# Altium project CANLINK_revA.PrjPcb
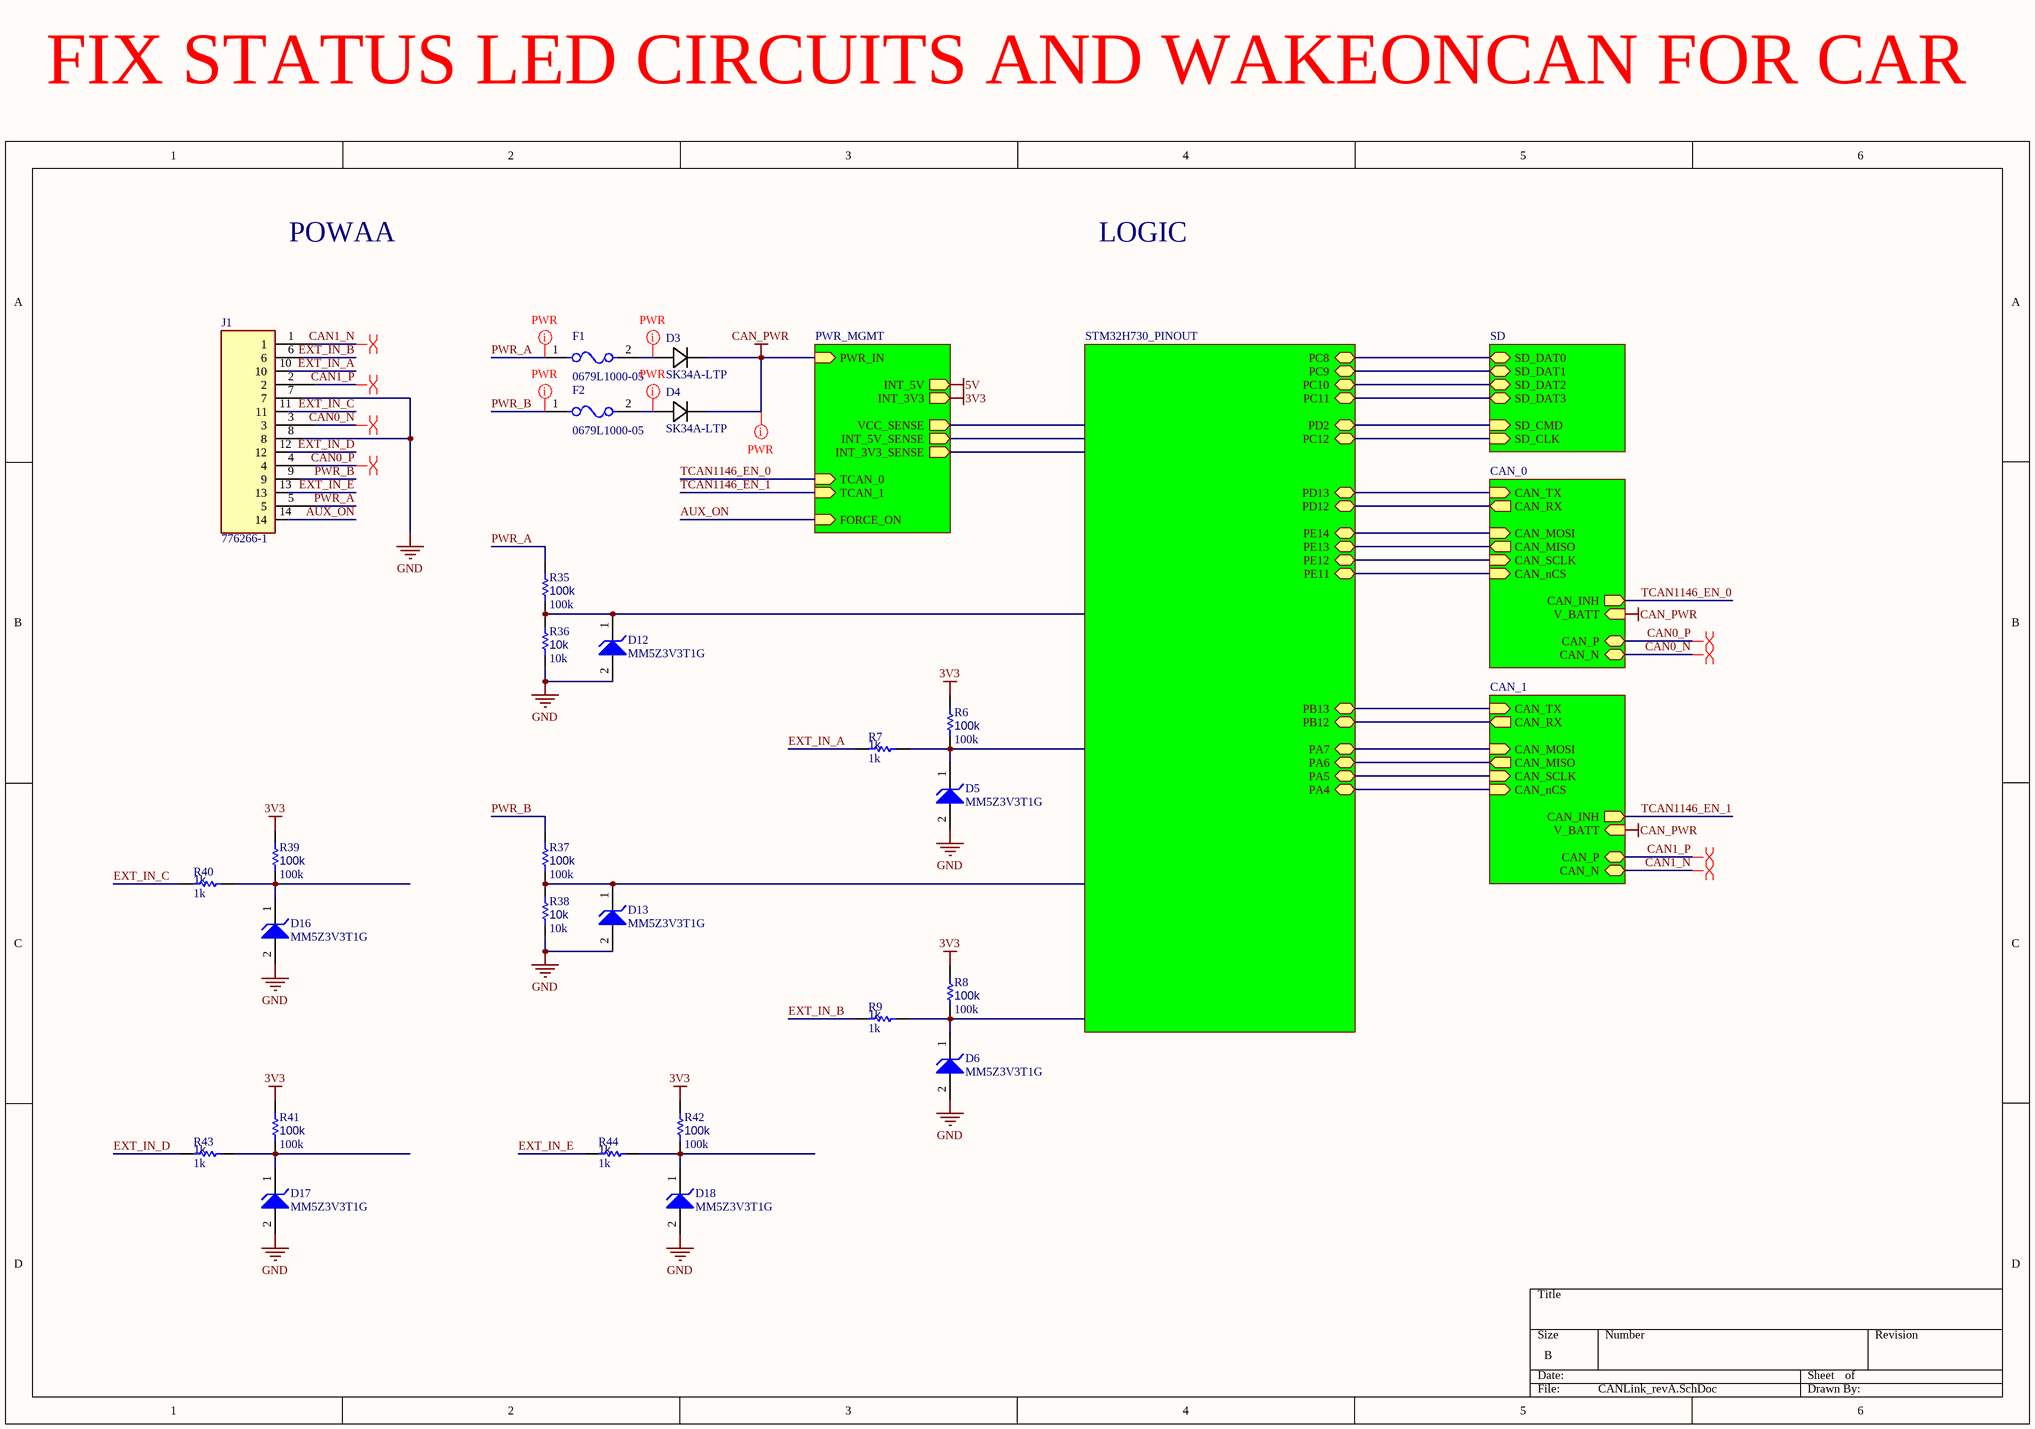
[diagram p0: CANLink_revA.SchDoc]
4 sheets, 98 parts. Net scope: hierarchical (ports join the sheet entries above them; power ports are global).
Board file: CANLINK_revA.PcbDoc
Sheets:
  CANLink_revA.SchDoc
    MCU_0 = STM32H730_PINOUT.SchDoc
    SD_0 = SD.SchDoc
    PWR_MGMT = PWR_MGMT.SchDoc

## Sheet CANLink_revA.SchDoc
size B; SheetNumber: 1; SheetTotal: 5

### Parts
D3  SK34A-LTP  [SK34A-LTP-Footprint-1]
D4  SK34A-LTP  [SK34A-LTP-Footprint-1]
D5  MM5Z3V3T1G  [ONSC-SOD-523-2-502-01_V]
D6  MM5Z3V3T1G  [ONSC-SOD-523-2-502-01_V]
D12  MM5Z3V3T1G  [ONSC-SOD-523-2-502-01_V]
D13  MM5Z3V3T1G  [ONSC-SOD-523-2-502-01_V]
D16  MM5Z3V3T1G  [ONSC-SOD-523-2-502-01_V]
D17  MM5Z3V3T1G  [ONSC-SOD-523-2-502-01_V]
D18  MM5Z3V3T1G  [ONSC-SOD-523-2-502-01_V]
F1  0679L1000-05  [FP-0679L-MFG]
F2  0679L1000-05  [FP-0679L-MFG]
J1  776266-1  [776266-1-Footprint-1]
R6  100k  [R0603B]
R7  1k  [R0603B]
R8  100k  [R0603B]
R9  1k  [R0603B]
R35  100k  [R0603B]
R36  10k  [R0603B]
R37  100k  [R0603B]
R38  10k  [R0603B]
R39  100k  [R0603B]
R40  1k  [R0603B]
R41  100k  [R0603B]
R42  100k  [R0603B]
R43  1k  [R0603B]
R44  1k  [R0603B]

### Sub-sheets
CAN_0 = TCAN1146_PINOUT (file not in this document): CAN_TX (in), CAN_RX (out), CAN_SCLK (in), CAN_MISO (out), CAN_MOSI (in), CAN_nCS (in), CAN_INH (out), V_BATT (in), CAN_P (bidir), CAN_N (bidir)
CAN_1 = TCAN1146_PINOUT (file not in this document): CAN_TX (in), CAN_RX (out), CAN_SCLK (in), CAN_MISO (out), CAN_MOSI (in), CAN_nCS (in), CAN_INH (out), V_BATT (in), CAN_P (bidir), CAN_N (bidir)
MCU_0 = STM32H730_PINOUT: PB12 (bidir), PB13 (bidir), PA4 (bidir), PA5 (bidir), PA6 (bidir), PA7 (bidir), PD12 (bidir), PD13 (bidir), PE11 (bidir), PE12 (bidir), PE13 (bidir), PE14 (bidir), PC9 (bidir), PC10 (bidir), PC11 (bidir), PC12 (bidir), PD2 (bidir), PC8 (bidir)
PWR_MGMT = PWR_MGMT: PWR_IN (in), INT_3V3 (out), VCC_SENSE (out), INT_3V3_SENSE (out), FORCE_ON (in), TCAN_0 (in), TCAN_1 (in), INT_5V (out), INT_5V_SENSE (out)
SD_0 = SD: SD_DAT0 (bidir), SD_DAT1 (bidir), SD_DAT2 (bidir), SD_DAT3 (bidir), SD_CMD (in), SD_CLK (in)

### Nets
3V3: R6.1 R8.1 R39.1 R41.1 R42.1 ; sheet PWR_MGMT/INT_3V3
CAN_PWR: D3.1(CATHODE) D4.1(CATHODE) ; sheet CAN_1/V_BATT, sheet PWR_MGMT/PWR_IN, sheet CAN_0/V_BATT
GND: D5.2(A) D6.2(A) D12.2(A) D13.2(A) D16.2(A) D17.2(A) D18.2(A) J1.7 J1.8 R36.2 R38.2
AUX_ON: J1.14 ; sheet PWR_MGMT/FORCE_ON
CAN0_N: J1.3 ; sheet CAN_0/CAN_N
CAN0_P: J1.4 ; sheet CAN_0/CAN_P
CAN1_N: J1.1 ; sheet CAN_1/CAN_N
CAN1_P: J1.2 ; sheet CAN_1/CAN_P
EXT_IN_A: J1.10 R7.2
EXT_IN_B: J1.6 R9.2
EXT_IN_C: J1.11 R40.2
EXT_IN_D: J1.12 R43.2
EXT_IN_E: J1.13 R44.2
PWR_A: F1.1 J1.5 R35.1
PWR_B: F2.1 J1.9 R37.1
SD_CLK: sheet MCU_0/PC12, sheet SD_0/SD_CLK
SD_CMD: sheet MCU_0/PD2, sheet SD_0/SD_CMD
SD_DAT0: sheet MCU_0/PC8, sheet SD_0/SD_DAT0
SD_DAT1: sheet MCU_0/PC9, sheet SD_0/SD_DAT1
SD_DAT2: sheet MCU_0/PC10, sheet SD_0/SD_DAT2
SD_DAT3: sheet MCU_0/PC11, sheet SD_0/SD_DAT3
TCAN1146_EN_0: sheet PWR_MGMT/TCAN_0, sheet CAN_0/CAN_INH
TCAN1146_EN_1: sheet CAN_1/CAN_INH, sheet PWR_MGMT/TCAN_1
NetD3_2: D3.2(ANODE) F1.2
NetD4_2: D4.2(ANODE) F2.2
NetD5_1: D5.1(K) R6.2 R7.1
NetD6_1: D6.1(K) R8.2 R9.1
NetD12_1: D12.1(K) R35.2 R36.1
NetD13_1: D13.1(K) R37.2 R38.1
NetD16_1: D16.1(K) R39.2 R40.1
NetD17_1: D17.1(K) R41.2 R43.1
NetD18_1: D18.1(K) R42.2 R44.1
NetU4_28: sheet MCU_0/PA4, sheet CAN_1/CAN_nCS
NetU4_29: sheet MCU_0/PA5, sheet CAN_1/CAN_SCLK
NetU4_30: sheet MCU_0/PA6, sheet CAN_1/CAN_MISO
NetU4_31: sheet MCU_0/PA7, sheet CAN_1/CAN_MOSI
NetU4_41: sheet MCU_0/PE11, sheet CAN_0/CAN_nCS
NetU4_42: sheet MCU_0/PE12, sheet CAN_0/CAN_SCLK
NetU4_43: sheet MCU_0/PE13, sheet CAN_0/CAN_MISO
NetU4_44: sheet MCU_0/PE14, sheet CAN_0/CAN_MOSI
NetU4_51: sheet MCU_0/PB12, sheet CAN_1/CAN_RX
NetU4_52: sheet MCU_0/PB13, sheet CAN_1/CAN_TX
NetU4_59: sheet MCU_0/PD12, sheet CAN_0/CAN_RX
NetU4_60: sheet MCU_0/PD13, sheet CAN_0/CAN_TX

### Layout directives
differential pair: CAN0_N, CAN0_P, CAN1_N, CAN1_P
net class PWR: CAN_PWR, NetD3_2, NetD4_2, PWR_A, PWR_B

### Notes on the sheet
- FIX STATUS LED CIRCUITS AND WAKEONCAN FOR CAR
- POWAA
- LOGIC

### Library data of the parts
D3 D4 = CMP-004-00058-2: Rectifier Diode, Schottky, 1 Phase, 1 Element, 3A, 40V V(RRM), Silicon, DO-214AC; Forward Voltage: 500mV; Max Operating Temperature: 125°C; Pins: 2; RoHS Compliant: Yes
D5 D6 D12 D13 D16-D18 = CMP-1060-00750-1: Zener Voltage Regulator, 500 mW, 2-Pin SOD-523, Pb-Free, Tape and Reel; Manufacturer: On Semiconductor; P Max (W): 0.5; VZ Typ (V): 3.3; RoHS: Pb-Free; ComponentLink2Description: Datasheet; PackageReference: SOD-523-2-502-01; DatasheetVersion: Rev. 10; ComponentLink1Description: Manufacturer URL; PackageVersion: Rev. E, 09/2010; ComponentLink3URL: http://www.onsemi.com/pub_link/Collateral/502-01.PDF; ComponentLink2URL: http://www.onsemi.cn/pub_link/Collateral/MM5Z2V4T1-D.PDF; Mounting Technology: Surface Mount; PartNumber: MM5Z3V3T1G; Packing: Tape and Reel; PackageDescription: 2-Pin SOD, Body 1.2 x 0.8 mm; ComponentLink1URL: http://www.onsemi.com/; ComponentLink3Description: Package Specification
F1 F2 = CMP-16042-000002-1: DIFF P#!!! / FUSE BRD MNT 1A 125VAC/VDC; Manufacturer: Bel Fuse; Manufacturer Part Number: 0679L9150-01; Max Fuse Ac Voltage: 125V; Fuse Blow Speed: Fast; Fuse Current: 15A; Fuse I2T: 103.5A2Sec; Fuse Interrupt Ac Current: 50A; Automotive Grade: Grade 1; Value: 0.0038Ω; Fuse Interrupt Dc Current: 300A; Fuse Voltage Drop: 0.13V; Device Class L2: Fuses; ComponentLink2URL: https://www.belfuse.com/resources/CircuitProtection/datasheets/0679L%20Sep2016.pdf; Package: 0679L; Height: 2.79mm; Digikey Description: FUSE BRD MNT 15A 125VAC/VDC; Temperature Range High: +125°C; Device Class L3: unset; Octopart: https://octopart.com/0679l9150-01-bel+fuse-70850665; Temperature Range Low: -55°C; Max Fuse Dc Voltage: 125V; Ipc Land Pattern Name: CAPC610254X254; Category: Fuse; Lead Free: Yes; Automotive: Yes; Resistance: 0.0038Ω; RoHS: TRUE; Device Class L1: Circuit Protection; ComponentLink2Description: Datasheet; Temperature: -55°C to +125°C; Voltage Rating: 125V
J1 = CMP-002-00087-1: Board Connector; Connector Type: BOARD CONNECTOR; RoHS Compliant: Yes
R6-R9 R35-R44 = CMP-009-00002-14: Resistor
  R6 R8 R35 R37 R39 R41 R42: Value: 100k
  R7 R9 R40 R43 R44: Value: 1k
  R36 R38: Value: 10k

## Sheet STM32H730_PINOUT.SchDoc
size C; SheetNumber: 5; SheetTotal: 5
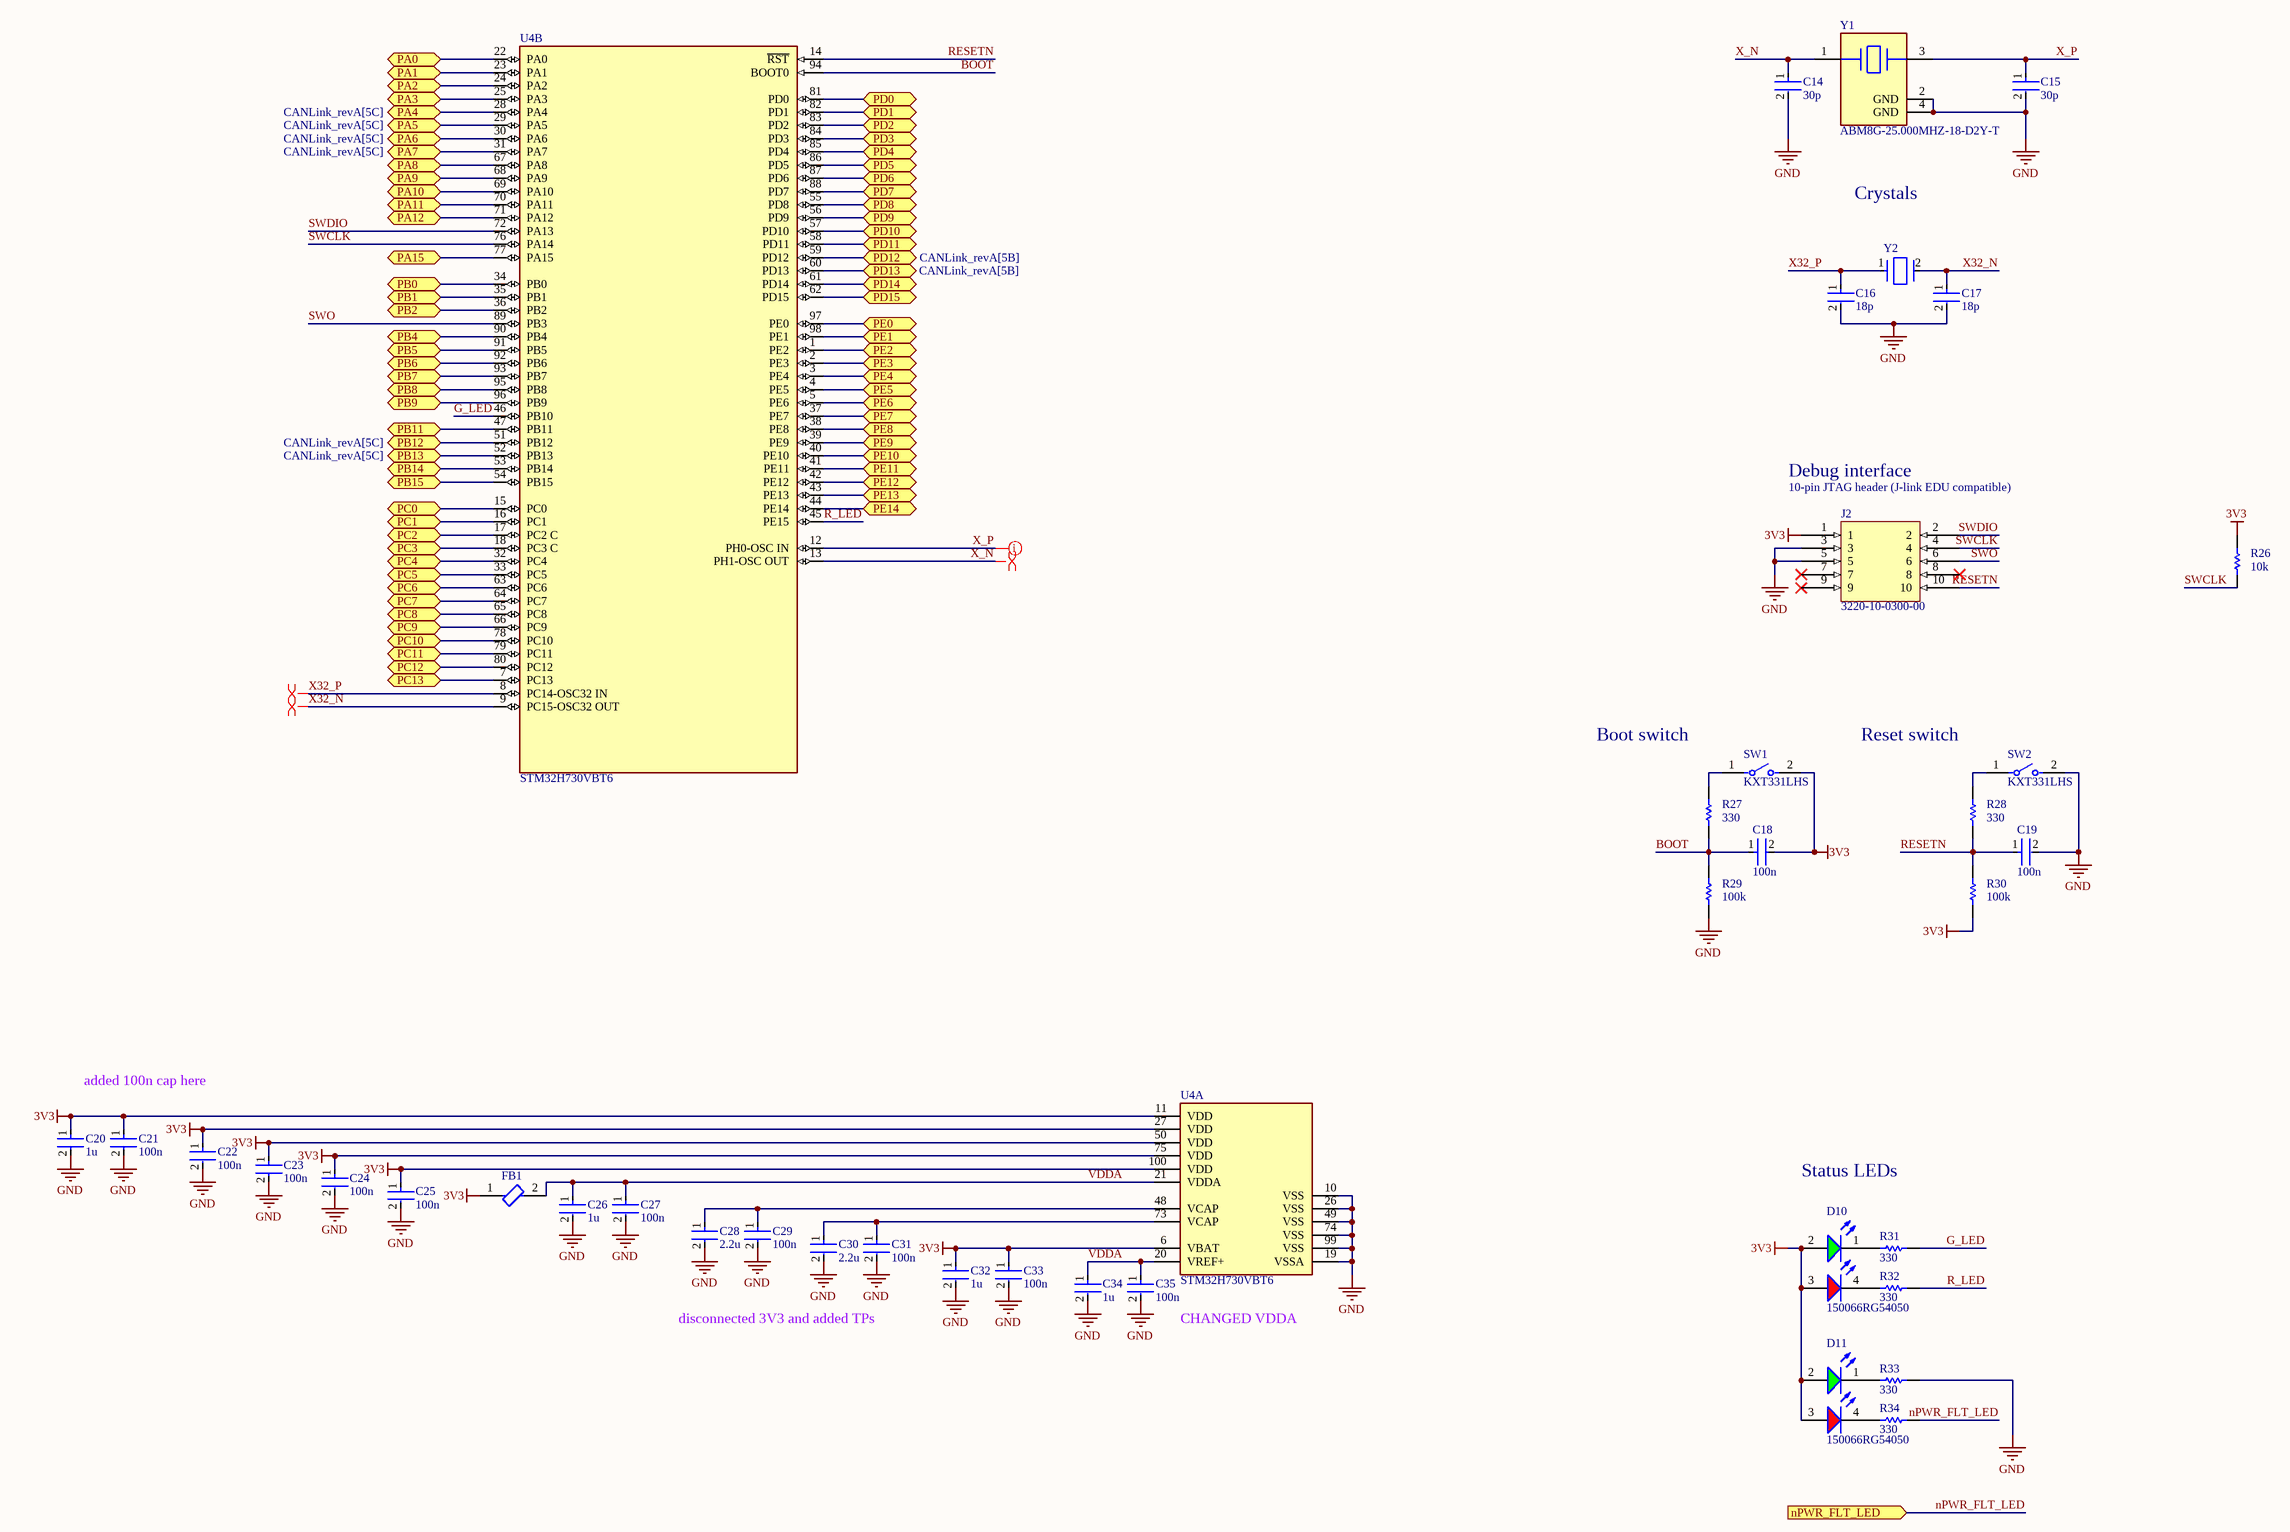
[diagram p1: STM32H730_PINOUT.SchDoc]

### Parts
C14  30p  [FP-0402-L_1_0_0_05-W_0_5-IPC_A]
C15  30p  [FP-0402-L_1_0_0_05-W_0_5-IPC_A]
C16  18p  [FP-0402-L_1_0_0_05-W_0_5-IPC_A]
C17  18p  [FP-0402-L_1_0_0_05-W_0_5-IPC_A]
C18  100n  [FP-0402-L_1_0_0_05-W_0_5-IPC_A]
C19  100n  [FP-0402-L_1_0_0_05-W_0_5-IPC_A]
C20  1u  [FP-0402-L_1_0_0_05-W_0_5-IPC_A]
C21  100n  [FP-0402-L_1_0_0_05-W_0_5-IPC_A]
C22  100n  [FP-0402-L_1_0_0_05-W_0_5-IPC_A]
C23  100n  [FP-0402-L_1_0_0_05-W_0_5-IPC_A]
C24  100n  [FP-0402-L_1_0_0_05-W_0_5-IPC_A]
C25  100n  [FP-0402-L_1_0_0_05-W_0_5-IPC_A]
C26  1u  [FP-0402-L_1_0_0_05-W_0_5-IPC_A]
C27  100n  [FP-0402-L_1_0_0_05-W_0_5-IPC_A]
C28  2.2u  [FP-0402-L_1_0_0_05-W_0_5-IPC_A]
C29  100n  [FP-0402-L_1_0_0_05-W_0_5-IPC_A]
C30  2.2u  [FP-0402-L_1_0_0_05-W_0_5-IPC_A]
C31  100n  [FP-0402-L_1_0_0_05-W_0_5-IPC_A]
C32  1u  [FP-0402-L_1_0_0_05-W_0_5-IPC_A]
C33  100n  [FP-0402-L_1_0_0_05-W_0_5-IPC_A]
C34  1u  [FP-0402-L_1_0_0_05-W_0_5-IPC_A]
C35  100n  [FP-0402-L_1_0_0_05-W_0_5-IPC_A]
D10  150066RG54050  [WL-SBCD_0606]
D11  150066RG54050  [WL-SBCD_0606]
FB1  BLM15PX601SN1D  [FP-BLM15-0_05-IPC_A]  (value not drawn)
J2  3220-10-0300-00  [3220-10-0300-00-Footprint-1]
R26  10k  [R0603B]
R27  330  [R0603B]
R28  330  [R0603B]
R29  100k  [R0603B]
R30  100k  [R0603B]
R31  330  [R0603B]
R32  330  [R0603B]
R33  330  [R0603B]
R34  330  [R0603B]
SW1  KXT331LHS  [FP-KXT331LHS-MFG]
SW2  KXT331LHS  [FP-KXT331LHS-MFG]
U4  STM32H730VBT6  [FP-LQFP100-1L-IPC_C]  (parts A,B of 2)
Y1  ABM8G-25.000MHZ-18-D2Y-T  [FP-ABM8G-MFG]
Y2  ECS-.327-12.5-1210-TR  [FP-ECX-1210-MFG]  (value not drawn)

### Ports
nPWR_FLT_LED (in), PA0 (bidir), PA1 (bidir), PA2 (bidir), PA3 (bidir), PA4 (bidir, see CANLink_revA[5C]), PA5 (bidir, see CANLink_revA[5C]), PA6 (bidir, see CANLink_revA[5C]), PA7 (bidir, see CANLink_revA[5C]), PA8 (bidir), PA9 (bidir), PA10 (bidir), PA11 (bidir), PA12 (bidir), PA15 (bidir), PB0 (bidir), PB1 (bidir), PB2 (bidir), PB4 (bidir), PB5 (bidir), PB6 (bidir), PB7 (bidir), PB8 (bidir), PB9 (bidir), PB11 (bidir), PB12 (bidir, see CANLink_revA[5C]), PB13 (bidir, see CANLink_revA[5C]), PB14 (bidir), PB15 (bidir), PC0 (bidir), PC1 (bidir), PC2 (bidir), PC3 (bidir), PC4 (bidir), PC5 (bidir), PC6 (bidir), PC7 (bidir), PC8 (bidir), PC9 (bidir), PC10 (bidir), PC11 (bidir), PC12 (bidir), PC13 (bidir), PD0 (bidir), PD1 (bidir), PD2 (bidir), PD3 (bidir), PD4 (bidir), PD5 (bidir), PD6 (bidir), PD7 (bidir), PD8 (bidir), PD9 (bidir), PD10 (bidir), PD11 (bidir), PD12 (bidir, see CANLink_revA[5B]), PD13 (bidir, see CANLink_revA[5B]), PD14 (bidir), PD15 (bidir), PE0 (bidir), PE1 (bidir), PE2 (bidir), PE3 (bidir), PE4 (bidir), PE5 (bidir), PE6 (bidir), PE7 (bidir), PE8 (bidir), PE9 (bidir), PE10 (bidir), PE11 (bidir), PE12 (bidir), PE13 (bidir), PE14 (bidir)

### Nets
3V3: C18.2 C20.1 C21.1 C22.1 C23.1 C24.1 C25.1 C32.1 C33.1 D10.2(A) D10.3(A) D11.2(A) D11.3(A) FB1.1 J2.1 R26.2 R30.1 SW1.2 U4.6(VBAT) U4.11(VDD) U4.27(VDD) U4.50(VDD) U4.75(VDD) U4.100(VDD)
GND: C14.2 C15.2 C16.2 C17.2 C19.2 C20.2 C21.2 C22.2 C23.2 C24.2 C25.2 C26.2 C27.2 C28.2 C29.2 C30.2 C31.2 C32.2 C33.2 C34.2 C35.2 J2.3 J2.5 R29.1 R33.1 SW2.2 U4.10(VSS) U4.19(VSSA) U4.26(VSS) U4.49(VSS) U4.74(VSS) U4.99(VSS) Y1.2(GND) Y1.4(GND)
BOOT: C18.1 R27.1 R29.2 U4.94(BOOT0)
G_LED: R31.1 U4.46(PB10)
nPWR_FLT_LED: R34.1 ; port nPWR_FLT_LED
R_LED: R32.1 U4.45(PE15)
RESETN: C19.1 J2.10 R28.1 R30.2 U4.14(~{RST})
SD_CLK: U4.80(PC12) ; port PC12
SD_CMD: U4.83(PD2) ; port PD2
SD_DAT0: U4.65(PC8) ; port PC8
SD_DAT1: U4.66(PC9) ; port PC9
SD_DAT2: U4.78(PC10) ; port PC10
SD_DAT3: U4.79(PC11) ; port PC11
SWCLK: J2.4 R26.1 U4.76(PA14)
SWDIO: J2.2 U4.72(PA13)
SWO: J2.6 U4.89(PB3)
VDDA: C26.1 C27.1 C34.1 C35.1 FB1.2 U4.20(VREF+) U4.21(VDDA)
X32_N: C17.1 U4.9(PC15-OSC32_OUT) Y2.2(Out/In)
X32_P: C16.1 U4.8(PC14-OSC32_IN) Y2.1(In/Out)
X_N: C14.1 U4.13(PH1-OSC_OUT) Y1.1
X_P: C15.1 U4.12(PH0-OSC_IN) Y1.3
NetC28_1: C28.1 C29.1 U4.48(VCAP)
NetC30_1: C30.1 C31.1 U4.73(VCAP)
NetD10_1: D10.1(K) R31.2
NetD10_4: D10.4(K) R32.2
NetD11_1: D11.1(K) R33.2
NetD11_4: D11.4(K) R34.2
NetR27_2: R27.2 SW1.1
NetR28_2: R28.2 SW2.1
NetU4_1: U4.1(PE2) ; port PE2
NetU4_2: U4.2(PE3) ; port PE3
NetU4_3: U4.3(PE4) ; port PE4
NetU4_4: U4.4(PE5) ; port PE5
NetU4_5: U4.5(PE6) ; port PE6
NetU4_7: U4.7(PC13) ; port PC13
NetU4_15: U4.15(PC0) ; port PC0
NetU4_16: U4.16(PC1) ; port PC1
NetU4_17: U4.17(PC2_C) ; port PC2
NetU4_18: U4.18(PC3_C) ; port PC3
NetU4_22: U4.22(PA0) ; port PA0
NetU4_23: U4.23(PA1) ; port PA1
NetU4_24: U4.24(PA2) ; port PA2
NetU4_25: U4.25(PA3) ; port PA3
NetU4_28: U4.28(PA4) ; port PA4
NetU4_29: U4.29(PA5) ; port PA5
NetU4_30: U4.30(PA6) ; port PA6
NetU4_31: U4.31(PA7) ; port PA7
NetU4_32: U4.32(PC4) ; port PC4
NetU4_33: U4.33(PC5) ; port PC5
NetU4_34: U4.34(PB0) ; port PB0
NetU4_35: U4.35(PB1) ; port PB1
NetU4_36: U4.36(PB2) ; port PB2
NetU4_37: U4.37(PE7) ; port PE7
NetU4_38: U4.38(PE8) ; port PE8
NetU4_39: U4.39(PE9) ; port PE9
NetU4_40: U4.40(PE10) ; port PE10
NetU4_41: U4.41(PE11) ; port PE11
NetU4_42: U4.42(PE12) ; port PE12
NetU4_43: U4.43(PE13) ; port PE13
NetU4_44: U4.44(PE14) ; port PE14
NetU4_47: U4.47(PB11) ; port PB11
NetU4_51: U4.51(PB12) ; port PB12
NetU4_52: U4.52(PB13) ; port PB13
NetU4_53: U4.53(PB14) ; port PB14
NetU4_54: U4.54(PB15) ; port PB15
NetU4_55: U4.55(PD8) ; port PD8
NetU4_56: U4.56(PD9) ; port PD9
NetU4_57: U4.57(PD10) ; port PD10
NetU4_58: U4.58(PD11) ; port PD11
NetU4_59: U4.59(PD12) ; port PD12
NetU4_60: U4.60(PD13) ; port PD13
NetU4_61: U4.61(PD14) ; port PD14
NetU4_62: U4.62(PD15) ; port PD15
NetU4_63: U4.63(PC6) ; port PC6
NetU4_64: U4.64(PC7) ; port PC7
NetU4_67: U4.67(PA8) ; port PA8
NetU4_68: U4.68(PA9) ; port PA9
NetU4_69: U4.69(PA10) ; port PA10
NetU4_70: U4.70(PA11) ; port PA11
NetU4_71: U4.71(PA12) ; port PA12
NetU4_77: U4.77(PA15) ; port PA15
NetU4_81: U4.81(PD0) ; port PD0
NetU4_82: U4.82(PD1) ; port PD1
NetU4_84: U4.84(PD3) ; port PD3
NetU4_85: U4.85(PD4) ; port PD4
NetU4_86: U4.86(PD5) ; port PD5
NetU4_87: U4.87(PD6) ; port PD6
NetU4_88: U4.88(PD7) ; port PD7
NetU4_90: U4.90(PB4) ; port PB4
NetU4_91: U4.91(PB5) ; port PB5
NetU4_92: U4.92(PB6) ; port PB6
NetU4_93: U4.93(PB7) ; port PB7
NetU4_95: U4.95(PB8) ; port PB8
NetU4_96: U4.96(PB9) ; port PB9
NetU4_97: U4.97(PE0) ; port PE0
NetU4_98: U4.98(PE1) ; port PE1

Not connected (* = marked no-connect by the designer): J2 7* 8* 9*

### Layout directives
differential pair: X32_N, X32_P, X_N, X_P

### Notes on the sheet
- Crystals
- Debug interface
- (near J2) 10-pin JTAG header (J-link EDU compatible)
- Boot switch
- Reset switch
- added 100n cap here
- Status LEDs
- disconnected 3V3 and added TPs
- CHANGED VDDA

### Library data of the parts
C14-C35 = CMP-001-00058-1: LARGE PADS, 0402 CAP, CHANGE COMMENT TO MATCH REAL P/N; Capacitor Type: Ceramic; Min Operating Temperature: -55°C; Mounting Technology: Surface Mount; Pins: 2; Case/Package: 0402; RoHS Compliant: Yes; Max Operating Temperature: 85°C
D10 D11 = CMP-004-00040-2: Led, Red/Grn, 180Mcd/230Mcd, 624Nm/525Nm Rohs Compliant: Yes; Source: rgled.SchLib; Component Type: Standard; Design Item ID: CMP-004-00034-2; Pins: 4
FB1 = CMP-0686-00252-4: Chip Ferrite Bead, 0402, 600Ω @ 100MHz, 0.23Ω, 25%, 900mA; Number of Circuits: 1; Impedance: 600R; DC Resistance (DCR): 230mR; Material: Steel; Length: 1mm; Package Quantity: 10000; Height: 0.5mm; Width: 0.5mm; Max DC Current: 900mA; Number of Lines: 1; Termination: SMD/SMT; Packaging: Tape and Reel; Lead Free: Lead Free; Min Operating Temperature: -55°C; Max Operating Temperature: 125°C; Max Current Rating: 900mA; Case Code (Imperial): 0402; Number of Pins: 2; Current Rating: 900mA; Test Frequency: 100MHz; Case/Package: 0402; Tolerance: 25%; Case Code (Metric): 1005
J2 = CMP-001-0013-3: CONN HEADER SMD 10POS 1.27MM
R26-R34 = CMP-009-00002-14: Resistor
  R26: Value: 10k
  R27 R28 R31-R34: Value: 330
  R29 R30: Value: 100k
SW1 SW2 = CMP-10040-000029-1: SWITCH TACTILE SPST-NO 0.02A 15V; Operating Force: 240gf; Switch Travel: 0.13mm; Illumination Type: Non-Illuminated; Throw Configuration: SPST; Number of Ports: 1; Current Rating: 5A; Mechanical Life: 500000Cycles; Switch Function: Off-Mom; Connector Type: USB; Actuator Type: Standard; Gender: Receptacle; Number of Contacts: 24; Contact Plating: Gold; Insulation Color: Black; Min Operating Temperature: -40°C; Packaging: Tape and Reel; Flammability Rating: UL94 V-0; Max Operating Temperature: 85°C; Termination: Solder; Mount: Surface Mount
U4 = CMP-12105-000107-1: IC MCU 32BIT 128KB FLASH 100LQFP
Y1 = CMP-2000-05733-3: Crystal 25MHz ±20ppm (Tol) ±30ppm (Stability) 18pF FUND 60Ω 4-Pin SMD T/R; Series Resistance: 60R; Length: 3.2mm; Depth: 2.5mm; Packaging: Tape and Reel; Min Operating Temperature: -40°C; Operating Frequency: 25 MHz; Lead Free: Lead Free; Number of Pins: 4; Frequency Tolerance: 20ppm; Radiation Hardening: No; Max Operating Temperature: 85°C; Termination: SMD/SMT; Frequency Stability: 30ppm; Frequency: 25MHz; Series: ABM8G; Mount: Surface Mount; Package Quantity: 1000; Height: 0.039inch; Width: 0.098inch; Case/Package: CSMD; ESR (Equivalent Series Resistance): 60R; Load Capacitance: 18pF; Tolerance: 20ppm
Y2 = CMP-40224-000006-1: CRYSTAL 32.7680KHZ 12.5PF SMD; Manufacturer: ECS International; Frequency: 32.768kHz; Esr: 90kΩ; Tolerance: 20ppm; Device Class L1: Passive Components; Load Capacitance: 12.5pF; Temperature: -40°C to +85°C; ComponentLink2URL: https://ecsxtal.com/store/pdf/ECX-1210.pdf; Series: ECX-1210; Octopart: https://octopart.com/ecs-.327-12.5-1210-tr-ecs+international-81221340; ComponentLink2Description: Datasheet; Temperature Range Low: -40°C; Digikey Description: CRYSTAL 32.7680KHZ 12.5PF SMD; Lead Free: Yes; RoHS: TRUE; Device Class L3: Crystals; Automotive: No; Category: Crys; Height: 0.5mm; Manufacturer Part Number: ECS-.327-12.5-1210-TR; Temperature Range High: +85°C; Device Class L2: Crystals / Oscillators; Package: ECX-1210

## Sheet SD.SchDoc
size A; SheetNumber: 4; SheetTotal: 5
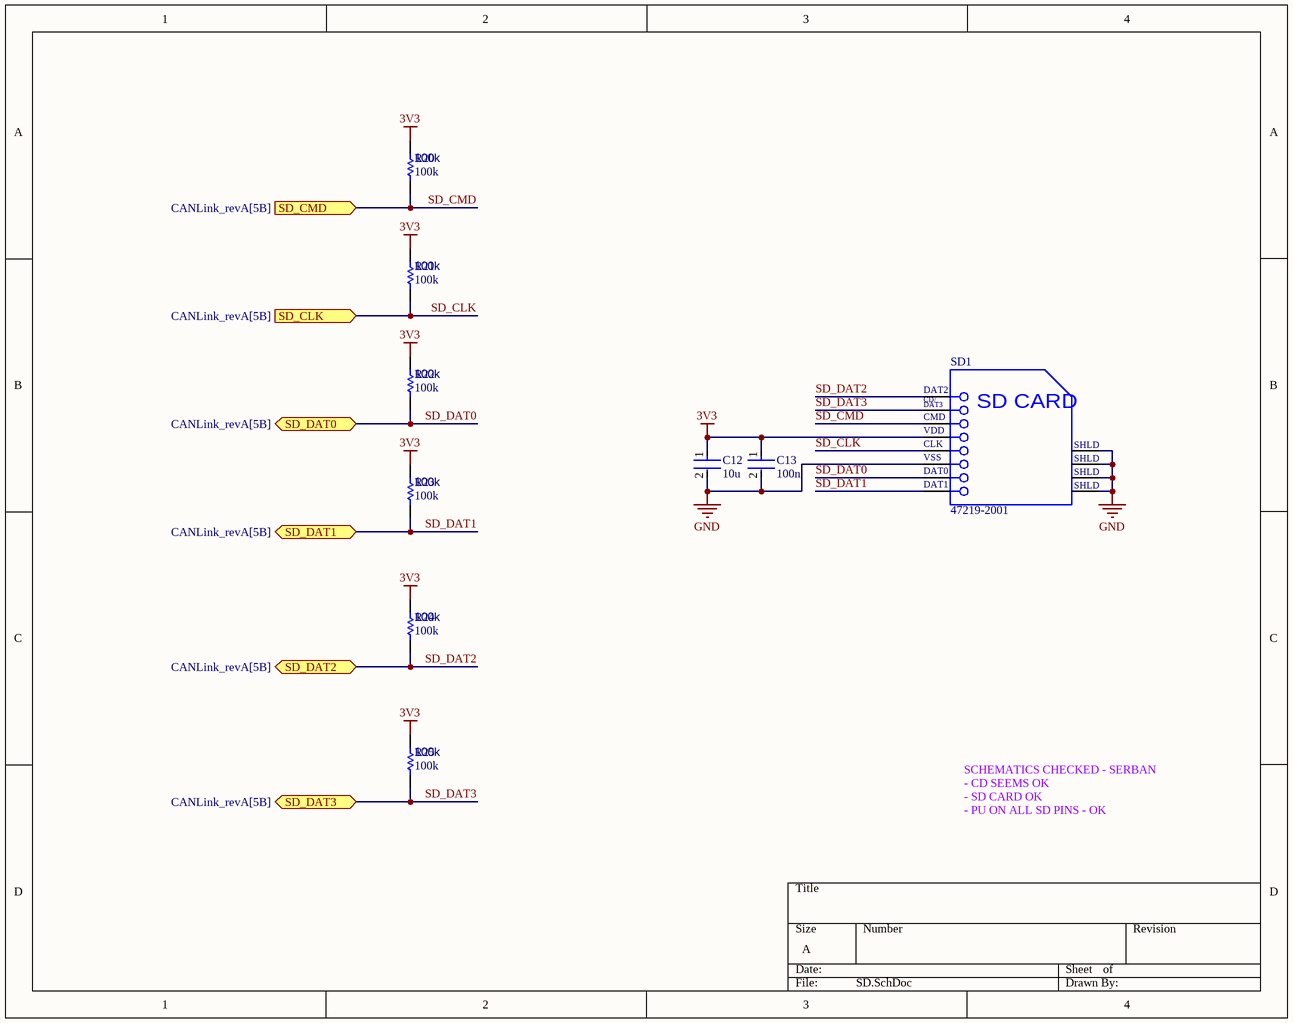
[diagram p2: SD.SchDoc]

### Parts
C12  10u  [FP-0402-L_1_0_0_05-W_0_5-IPC_A]
C13  100n  [FP-0402-L_1_0_0_05-W_0_5-IPC_A]
R20  100k  [R0603B]
R21  100k  [R0603B]
R22  100k  [R0603B]
R23  100k  [R0603B]
R24  100k  [R0603B]
R25  100k  [R0603B]
SD1  47219-2001  [MOLX-47219-2001-8_V]

### Ports
SD_CLK (in, see CANLink_revA[5B]), SD_CMD (in, see CANLink_revA[5B]), SD_DAT0 (bidir, see CANLink_revA[5B]), SD_DAT1 (bidir, see CANLink_revA[5B]), SD_DAT2 (bidir, see CANLink_revA[5B]), SD_DAT3 (bidir, see CANLink_revA[5B])

### Nets
3V3: C12.1 C13.1 R20.1 R21.1 R22.1 R23.1 R24.1 R25.1 SD1.4(VDD)
GND: C12.2 C13.2 SD1.6(VSS) SD1.9(SHLD) SD1.10(SHLD) SD1.11(SHLD) SD1.12(SHLD)
SD_CLK: R21.2 SD1.5(CLK) ; port SD_CLK
SD_CMD: R20.2 SD1.3(CMD) ; port SD_CMD
SD_DAT0: R22.2 SD1.7(DAT0) ; port SD_DAT0
SD_DAT1: R23.2 SD1.8(DAT1) ; port SD_DAT1
SD_DAT2: R24.2 SD1.1(DAT2) ; port SD_DAT2
SD_DAT3: R25.2 SD1.2(CD/DAT3) ; port SD_DAT3

### Notes on the sheet
- SCHEMATICS CHECKED - SERBAN
  - CD SEEMS OK
  - SD CARD OK
  - PU ON ALL SD PINS - OK
- (in symbol CMP-2000-05245-1) CD/; DAT3; SD CARD

### Library data of the parts
C12 C13 = CMP-001-00058-1: as C14 on sheet STM32H730_PINOUT; Min Operating Temperature: -55°C; Mounting Technology: Surface Mount; Pins: 2; Case/Package: 0402; RoHS Compliant: Yes; Max Operating Temperature: 85°C
  C12: Value: 10u
  C13: Value: 100n
R20-R25 = CMP-009-00002-14: Resistor; Value: 100k
SD1 = CMP-2000-05245-1: MicroSD Card Connector, Hinge Type, -40 to 85 degC, 8-Pin SMD, RoHS, Tape and Reel; Manufacturer: Molex; Current Rating: 500mA; Number of Contacts: 8; Pitch: 1.09mm; Insertion - Extraction Style: Hinged; Voltage Rating: 100VDC; Product: CardConnectors; Contact Material: CopperAlloy; Series: 47219; Packaging: Reel; Brand: Molex; Product Category: MemoryCardConnectors; Housing Material: Thermoplastic; Mounting Style: SMD/SMT; Termination Style: SMD; Datasheet Version: Rev. F, 06/2009; Card Type: microSD; Manufacturer URL: http://www.molex.com/; RoHS: Details; Datasheet URL: http://www.molex.com/pdm_docs/sd/472192001_sd.pdf; Factory Pack Quantity: 2400

## Sheet PWR_MGMT.SchDoc
size B; SheetNumber: 3; SheetTotal: 5
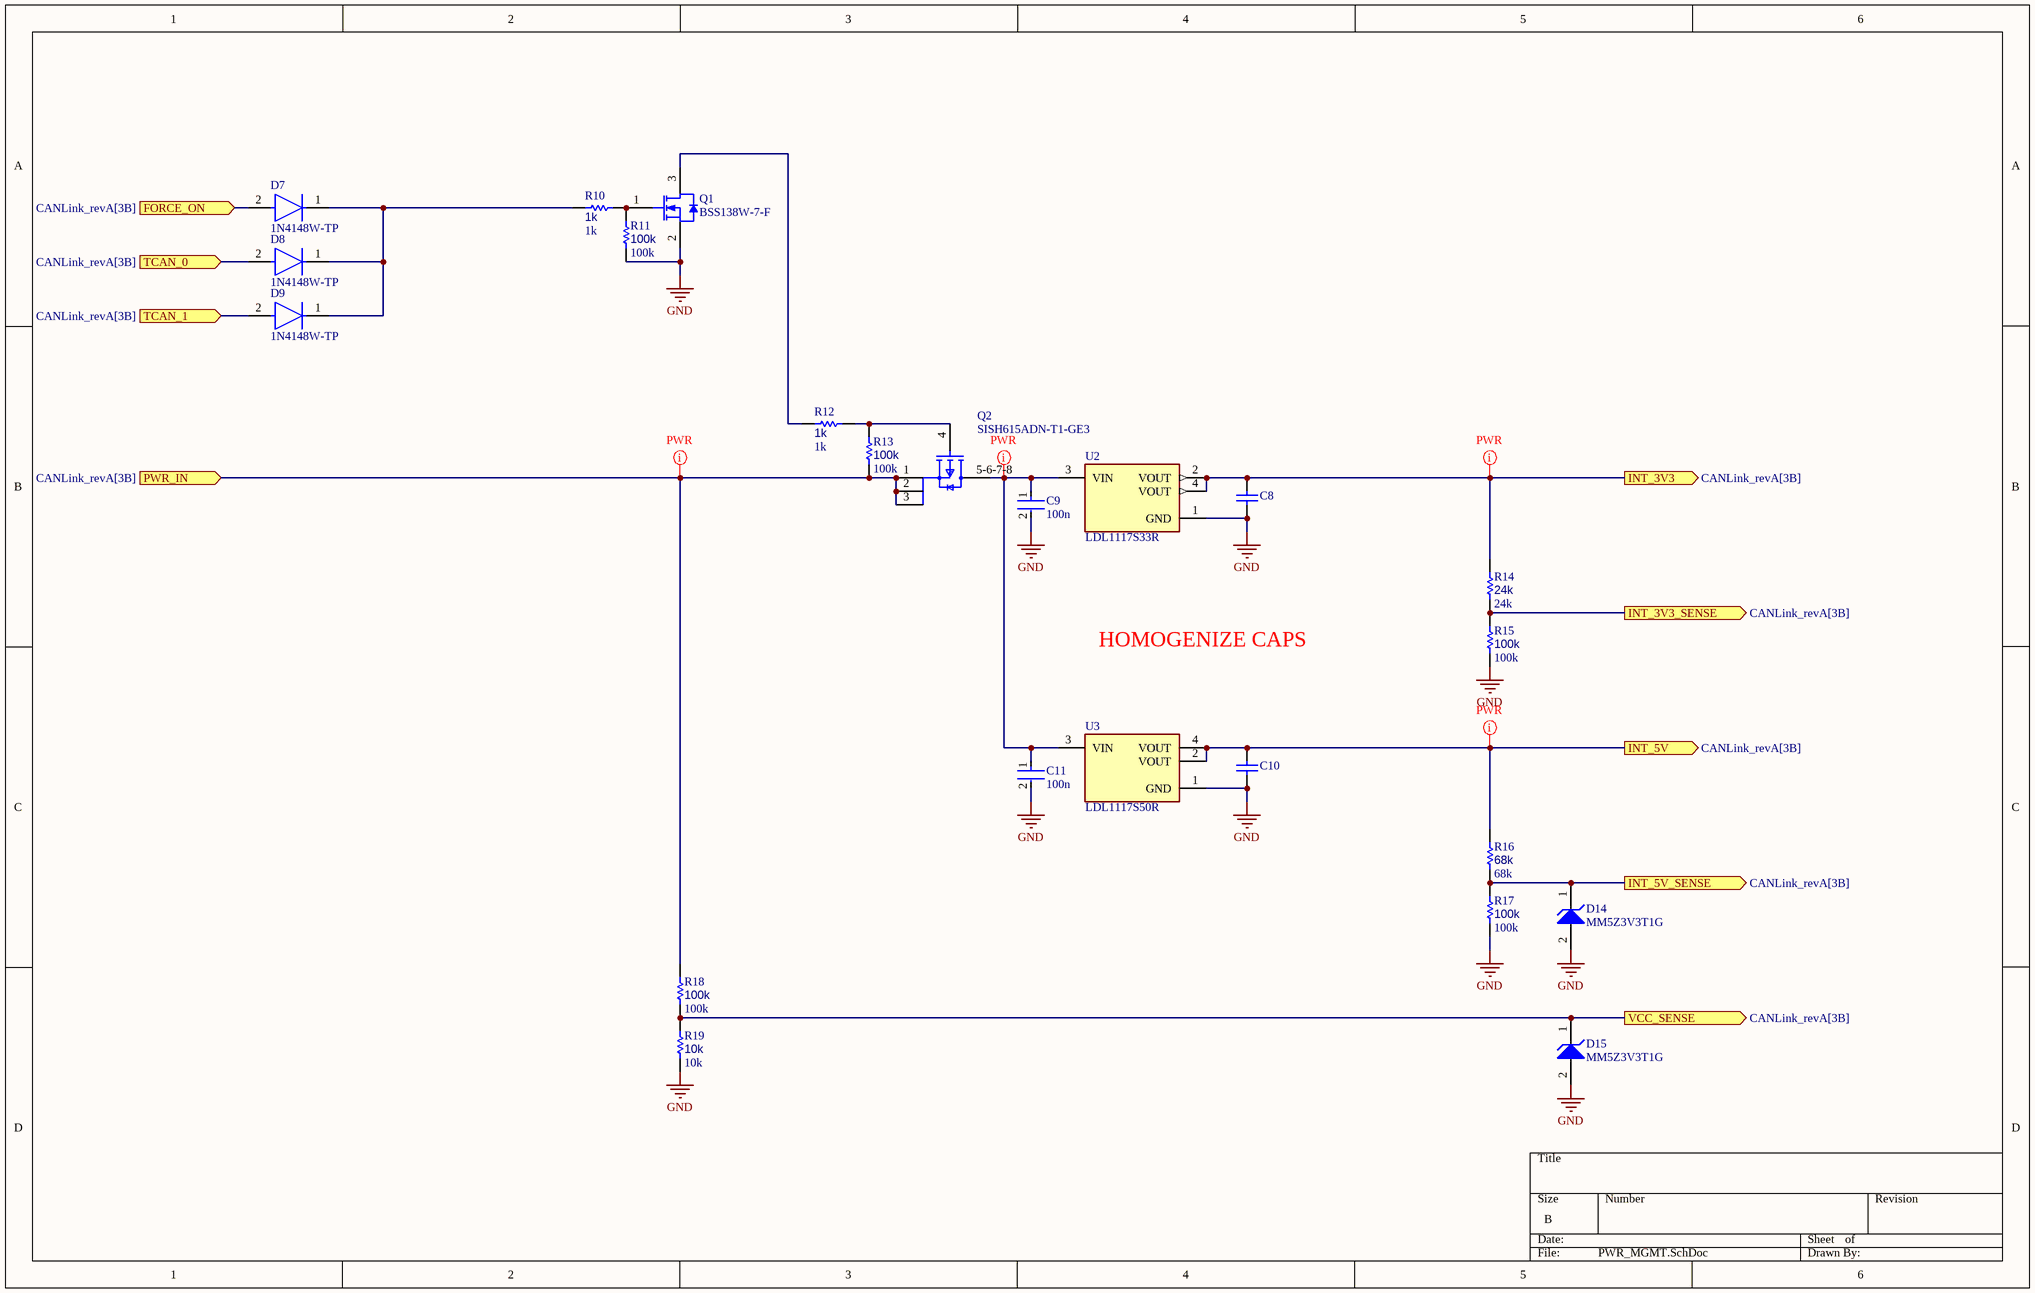
[diagram p3: PWR_MGMT.SchDoc]

### Parts
C8  0805ZG106ZAT2A  [CAPC2013X152X50NL20T25]  (value not drawn)
C9  100n  [FP-0402-L_1_0_0_05-W_0_5-IPC_A]
C10  0805ZG106ZAT2A  [CAPC2013X152X50NL20T25]  (value not drawn)
C11  100n  [FP-0402-L_1_0_0_05-W_0_5-IPC_A]
D7  1N4148W-TP  [FP-SOD-123-IPC_A]
D8  1N4148W-TP  [FP-SOD-123-IPC_A]
D9  1N4148W-TP  [FP-SOD-123-IPC_A]
D14  MM5Z3V3T1G  [ONSC-SOD-523-2-502-01_V]
D15  MM5Z3V3T1G  [ONSC-SOD-523-2-502-01_V]
Q1  BSS138W-7-F  [DIOD-SOT323-3_V]
Q2  SISH615ADN-T1-GE3  [SISH615ADN-T1-GE3-Footprint-1]
R10  1k  [R0603B]
R11  100k  [R0603B]
R12  1k  [R0603B]
R13  100k  [R0603B]
R14  24k  [R0603B]
R15  100k  [R0603B]
R16  68k  [R0603B]
R17  100k  [R0603B]
R18  100k  [R0603B]
R19  10k  [R0603B]
U2  LDL1117S33R  [FP-SOT223-0046067-IPC_C]
U3  LDL1117S50R  [FP-SOT-223-0046067_14-MFG]

### Ports
FORCE_ON (in, see CANLink_revA[3B]), INT_3V3 (out, see CANLink_revA[3B]), INT_3V3_SENSE (out, see CANLink_revA[3B]), INT_5V (out, see CANLink_revA[3B]), INT_5V_SENSE (out, see CANLink_revA[3B]), PWR_IN (in, see CANLink_revA[3B]), TCAN_0 (in, see CANLink_revA[3B]), TCAN_1 (in, see CANLink_revA[3B]), VCC_SENSE (out, see CANLink_revA[3B])

### Nets
3V3: C8.2 R14.1 U2.2(VOUT) U2.4(VOUT) ; port INT_3V3
5V: C10.2 R16.1 U3.2(VOUT) U3.4(VOUT) ; port INT_5V
CAN_PWR: Q2.1(S) Q2.2(S) Q2.3(S) R13.2 R18.1 ; port PWR_IN
GND: C8.1 C9.2 C10.1 C11.2 D14.2(A) D15.2(A) Q1.2(S) R11.2 R15.2 R17.2 R19.2 U2.1(GND) U3.1(GND)
AUX_ON: D7.2(A) ; port FORCE_ON
TCAN1146_EN_0: D8.2(A) ; port TCAN_0
TCAN1146_EN_1: D9.2(A) ; port TCAN_1
NetC9_1: C9.1 C11.1 Q2.5-6-7-8(D) U2.3(VIN) U3.3(VIN)
NetD7_1: D7.1(C) D8.1(C) D9.1(C) R10.2
NetD14_1: D14.1(K) R16.2 R17.1 ; port INT_5V_SENSE
NetD15_1: D15.1(K) R18.2 R19.1 ; port VCC_SENSE
NetQ1_1: Q1.1(G) R10.1 R11.1
NetQ1_3: Q1.3(D) R12.2
NetQ2_4: Q2.4(G) R12.1 R13.1
NetR14_2: R14.2 R15.1 ; port INT_3V3_SENSE

### Layout directives
net class PWR: 3V3, 5V, CAN_PWR, NetC9_1

### Notes on the sheet
- HOMOGENIZE CAPS

### Library data of the parts
C8 C10 = CMP-2007-04523-1: Manufacturer: AVX Interconnect / Elco; Part Number: 0805ZG106ZAT2A
C9 C11 = CMP-001-00058-1: as C14 on sheet STM32H730_PINOUT; Min Operating Temperature: -55°C; Mounting Technology: Surface Mount; Pins: 2; Case/Package: 0402; RoHS Compliant: Yes; Max Operating Temperature: 85°C
D7-D9 = CMP-2000-04993-2: DIODE GEN PURP 100V 150MA SOD123; Max Reverse Leakage Current: 5uA; Max Surge Current: 2A; Reverse Recovery Time: 4ns; Polarity: Standard; Capacitance: 4pF; Max Forward Surge Current (Ifsm): 1A; Element Configuration: Single; Power Dissipation: 400mW; Forward Voltage: 1V; Radiation Hardening: No; Lead Free: Lead Free; Max Reverse Voltage (DC): 100V; Current Rating: 150mA; Forward Current: 150mA; Packaging: Tape and Reel; Number of Pins: 2; Package Quantity: 3000; Max Operating Temperature: 150°C; Min Operating Temperature: -65°C; Average Rectified Current: 150mA; Recovery Time: 4ns; Output Current: 150mA; Peak Non-Repetitive Surge Current: 2A; Width: 1.8mm; Voltage Rating (DC): 100V; Height: 1.2mm; Max Repetitive Reverse Voltage (Vrrm): 100V; Mount: Surface Mount; Length: 2.85mm
D14 D15 = CMP-1060-00750-1: as D5 on sheet CANLink_revA; RoHS: Pb-Free; ComponentLink2Description: Datasheet; PackageReference: SOD-523-2-502-01; DatasheetVersion: Rev. 10; ComponentLink1Description: Manufacturer URL; PackageVersion: Rev. E, 09/2010; ComponentLink3URL: http://www.onsemi.com/pub_link/Collateral/502-01.PDF; ComponentLink2URL: http://www.onsemi.cn/pub_link/Collateral/MM5Z2V4T1-D.PDF; Mounting Technology: Surface Mount; PartNumber: MM5Z3V3T1G; Packing: Tape and Reel; PackageDescription: 2-Pin SOD, Body 1.2 x 0.8 mm; ComponentLink1URL: http://www.onsemi.com/; ComponentLink3Description: Package Specification
Q1 = CMP-2000-05968-1: N-Channel Enhancement Mode Mosfet, 50 V, 200 mA, -55 to 150 degC, 6-Pin SOT-323, RoHS, Tape and Reel; Typical Turn-Off Delay Time: 20ns; Number of Channels: 1Channel; Type: EnhancementModeFieldEffectTransistor; Brand: DiodesIncorporated; Vds - Drain-Source Breakdown Voltage: 75V; Vgs - Gate-Source Voltage: 20V; Rds On - Drain-Source Resistance: 1.4Ohms; Transistor Type: 1N-Channel; Configuration: Single; Unit Weight: 0.000212oz; Pd - Power Dissipation: 200mW; Id - Continuous Drain Current: 200mA; Forward Transconductance - Min: 0.1S; Manufacturer URL: http://www.diodes.com/; Series: BSS138; Package Description: 3-Pin Small Outline Transistor, Body 2 x 1.25 mm, Pitch 0.65 mm; Mounting Technology: SurfaceMount; Product Category: MOSFET; RoHS: True; Maximum Operating Temperature: +150C; Height: 1mm; Length: 2.2mm; Technology: Si; Width: 1.35mm; Datasheet URL: http://www.diodes.com/_files/datasheets/ds30206.pdf; Manufacturer: DiodesIncorporated; Package / Case: SOT-323-3; Typical Turn-On Delay Time: 20ns; Transistor Polarity: N-Channel; Factory Pack Quantity: 3000; Packaging: Reel; Product: MOSFETSmallSignal; Datasheet Version: Rev. 11-2, 09/2013; Package Reference: SOT323; Minimum Operating Temperature: -55C; Mounting Style: SMD/SMT; Channel Mode: Enhancement
Q2 = CMP-013-00018-2: Trans MOSFET P-CH 20V 22.1A 8-Pin PowerPAK 1212 EP T/R; Source: SISH615ADN-T1-GE3.SchLib; Design Item ID: CMP-013-00036-4; Component Type: Standard; Pins: 5
R10-R19 = CMP-009-00002-14: Resistor
  R10 R12: Value: 1k
  R11 R13 R15 R17 R18: Value: 100k
  R14: Value: 24k
  R16: Value: 68k
  R19: Value: 10k
U2 = CMP-12153-000006-1: IC REG LINEAR 3.3V 1.2A SOT223; Manufacturer: STMicroelectronics; Output Type: Fixed; Min Supply Voltage: 2.6V; Number Of Outputs: 1; Dropout Voltage: 350mV; Output Current: 2A; Nominal Supply Current: 250uA; Standoff Height: 0.02mm; Max Supply Voltage: 18V; Max Junction Temp: +125°C; Accuracy Percentage: 2%; Automotive: No; Device Class L2: Power Management ICs; Height: 1.9mm; Octopart: https://octopart.com/ldl1117s33r-stmicroelectronics-81876163; Output Voltage: 3.3V; Package: SOT223-0046067; Lead Free: Yes; Temperature Range Low: -40°C; Category: IC; Device Class L1: Integrated Circuits (ICs); Ipc Land Pattern Name: SOT230P700X190-4; Mouser Description: LDL1117 Series 1.2 A 3.3 V High PSRR LDO Linear Voltage Regulator-SOT-223; ComponentLink2Description: Datasheet; ComponentLink2URL: https://www.st.com/resource/en/datasheet/ldl1117.pdf; Device Class L3: Voltage Regulators - Linear; Manufacturer Part Number: LDL1117S33R; Temperature Range High: +125°C; Digikey Description: IC REG LINEAR 3.3V 1.2A SOT223; Temperature: -40°C to +125°C; RoHS: TRUE
U3 = CMP-12153-000005-1: IC REG LINEAR 5V 1.2A SOT223; Manufacturer: STMicroelectronics; Standoff Height: 0.02mm; Min Supply Voltage: 2.6V; Nominal Supply Current: 250uA; Max Junction Temp: +150°C; Accuracy Percentage: 2%; Output Type: Fixed; Max Supply Voltage: 18V; Output Current: 2A; Number Of Outputs: 1; Dropout Voltage: 350mV; ComponentLink2Description: Datasheet; Temperature Range High: +125°C; Manufacturer Part Number: LDL1117S50R; Digikey Description: IC REG LINEAR 5V 1.2A SOT223; Device Class L2: Power Management ICs; RoHS: TRUE; Temperature: -40°C to +125°C; Device Class L3: Voltage Regulators - Linear; Automotive: No; Mouser Description: LDL1117 Series 1.2 A 5 V High PSRR LDO Linear Voltage Regulator - SOT-223; Package: SOT-223-0046067_14; ComponentLink2URL: https://www.st.com/content/ccc/resource/technical/document/datasheet/group3/0e/5a/00/ca/10/1a/4f/a5/DM00366442/files/DM00366442.pdf/jcr:content/translations/en.DM00366442.pdf; Output Voltage: 5V; Octopart: https://octopart.com/ldl1117s50r-stmicroelectronics-81876164; Category: IC; Device Class L1: Integrated Circuits (ICs); Temperature Range Low: -40°C; Height: 1.9mm; Lead Free: Yes

## Nets that join several sheets
3V3: CANLink_revA (5 pins), STM32H730_PINOUT (24 pins), SD (9 pins), PWR_MGMT (C8.2 R14.1 U2.2 U2.4)
CAN_PWR: CANLink_revA (D3.1 D4.1), PWR_MGMT (5 pins)
GND: CANLink_revA (11 pins), STM32H730_PINOUT (34 pins), SD (7 pins), PWR_MGMT (13 pins)
AUX_ON: CANLink_revA (J1.14), PWR_MGMT (D7.2)
SD_CLK: STM32H730_PINOUT (U4.80), SD (R21.2 SD1.5)
SD_CMD: STM32H730_PINOUT (U4.83), SD (R20.2 SD1.3)
SD_DAT0: STM32H730_PINOUT (U4.65), SD (R22.2 SD1.7)
SD_DAT1: STM32H730_PINOUT (U4.66), SD (R23.2 SD1.8)
SD_DAT2: STM32H730_PINOUT (U4.78), SD (R24.2 SD1.1)
SD_DAT3: STM32H730_PINOUT (U4.79), SD (R25.2 SD1.2)